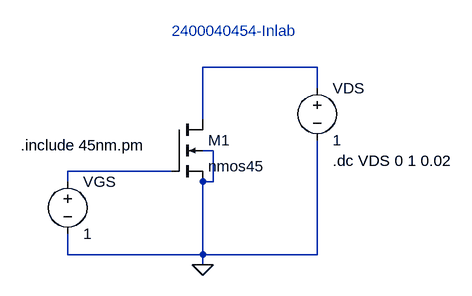
[diagram p0: schematic Nmos-L-W.asc]
Nmos-L-W.asc, the LTspice schematic file:
Version 4.1
SHEET 1 880 680
WIRE 416 16 240 16
WIRE 416 48 416 16
WIRE 240 96 240 16
WIRE 256 144 240 144
WIRE 192 176 32 176
WIRE 32 192 32 176
WIRE 256 192 256 144
WIRE 256 192 240 192
WIRE 32 304 32 272
WIRE 240 304 240 192
WIRE 240 304 32 304
WIRE 416 304 416 128
WIRE 416 304 240 304
WIRE 240 320 240 304
FLAG 240 320 0
SYMBOL voltage 32 176 R0
WINDOW 123 0 0 Left 0
WINDOW 39 0 0 Left 0
SYMATTR InstName VGS
SYMATTR Value 1
SYMBOL voltage 416 32 R0
WINDOW 123 0 0 Left 0
WINDOW 39 0 0 Left 0
SYMATTR InstName VDS
SYMATTR Value 1
SYMBOL nmos4 192 96 R0
SYMATTR InstName M1
SYMATTR Value nmos45
SYMATTR Value2 l=45n w=1u
TEXT 440 160 Left 2 !.dc VDS 0 1 0.02
TEXT -40 136 Left 2 !.include 45nm.pm
TEXT 192 -40 Left 2 ;2400040454-Inlab

The netlist it stands for:
* Nmos-L-W.asc
VGS N002 0 1
VDS N001 0 1
M1 N001 N002 0 0 nmos45 l=45n w=1u
.model NMOS NMOS
.model PMOS PMOS
.lib standard.mos
.dc VDS 0 1 0.02
.include 45nm.pm
* 2400040454-Inlab
.backanno
.end